# Altium schematic sheet USBandBatteryCharger.SchDoc
size A4; SheetNumber: 5; SheetTotal: 7
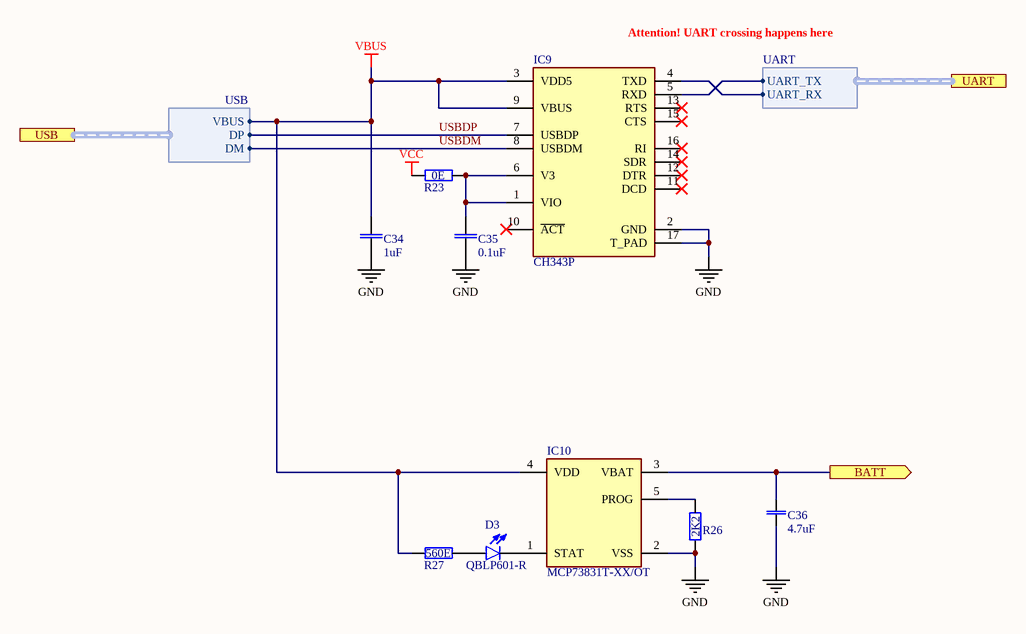
[diagram p0: USBandBatteryCharger.SchDoc]

## Parts
C34  1uF  [CAP0402]
C35  0.1uF  [CAP0402]
C36  4.7uF  [0805]
D3  QBLP601-R  [LED0603]
IC9  CH343P  [QFN16_3X3]
IC10  MCP73831T-XX/OT  [SOT23-5(MCP73831)]
R23  0E  [RES0402]  (value not drawn)
R26  2K2  [RES0402]  (value not drawn)
R27  560E  [RES0402]  (value not drawn)

## Ports
BATT (out), UART (harness UART), USB (harness USB)

## Harnesses
UART: UART_TX, UART_RX
USB: VBUS, DP, DM

## Nets
GND: C34.2 C35.1 C36.1 IC9.2(GND) IC9.17(T_PAD) IC10.2(VSS) R26.1
VBUS: C34.1 IC9.3(VDD5) IC9.9(VBUS) IC10.4(VDD) R27.1 ; port USB.VBUS
VCC: R23.1
BATT: C36.2 IC10.3(VBAT) ; port BATT
USBDM: IC9.8(USBDM) ; port USB.DM
USBDP: IC9.7(USBDP) ; port USB.DP
NetC35_2: C35.2 IC9.1(VIO) IC9.6(V3) R23.2
NetD3_1: D3.1 R27.2
NetD3_2: D3.2 IC10.1(STAT)
NetIC9_4: IC9.4(TXD) ; port UART.UART_RX
NetIC9_5: IC9.5(RXD) ; port UART.UART_TX
NetIC10_5: IC10.5(PROG) R26.2

Not connected (* = marked no-connect by the designer): IC9 10(~{ACT})* 11(DCD)* 12(DTR)* 13(RTS)* 14(SDR)* 15(CTS)* 16(RI)*

## Notes on the sheet
- (near IC9) Attention! UART crossing happens here

## Library data of the parts
C34 = CAP_0402: Manufacturer: Samsung Electro-Mechanics; Manufacturer Partnummber: CL05A105KO5NNNC; Value: 1uF
C35 = CAP_0402: Manufacturer: Samsung Electro-Mechanics; Manufacturer Partnummber: CL05A104KA5NNNC; Value: 0.1uF
C36 = 000090: Part Number: 000090; Manufacturer: Samsung Electro-Mechanics; Manufacturer Partnummber: CL21A475KOFNNNE; Component Type: Standard; ComponentLink1Description: Datasheet; ComponentLink2Description: Manufacturer Site; Value: 4.7uF; Digikey Number: 1276-1065-1-ND
D3 = QBLP601-R: Manufacturer: QT Brightek (QTB); Manufacturer Partnummber: QBLP601-R
IC9 = CH343P: Manufacturer: WCH; JLCPCB Part #: C2846043; Manufacturer Partnummber: CH343P
IC10 = MCP73831: Manufacturer: Microchip Technology; Manufacturer Partnummber: MCP73831T-2ACI/OT
R23 = RES_0402: Manufacturer: YAGEO; Manufacturer Partnummber: RC0402JR-070RL; Value: 0E
R26 = RES_0402: Manufacturer: YAGEO; Manufacturer Partnummber: RC0402FR-072K2L; Value: 2K2
R27 = RES_0402: Manufacturer: YAGEO; Manufacturer Partnummber: RC0402FR-07560RL; Value: 560E